# EasyEDA schematic ESP32 Bedsensor Dual with BME 30pin.json

## Sheets
1 Schematic: TITLE: ESP32 Bed Sensor - Dual with BME280; REV: 1.0; Date: 14-07-2022; Sheet: 1/1; Drawn By: Iain Hay
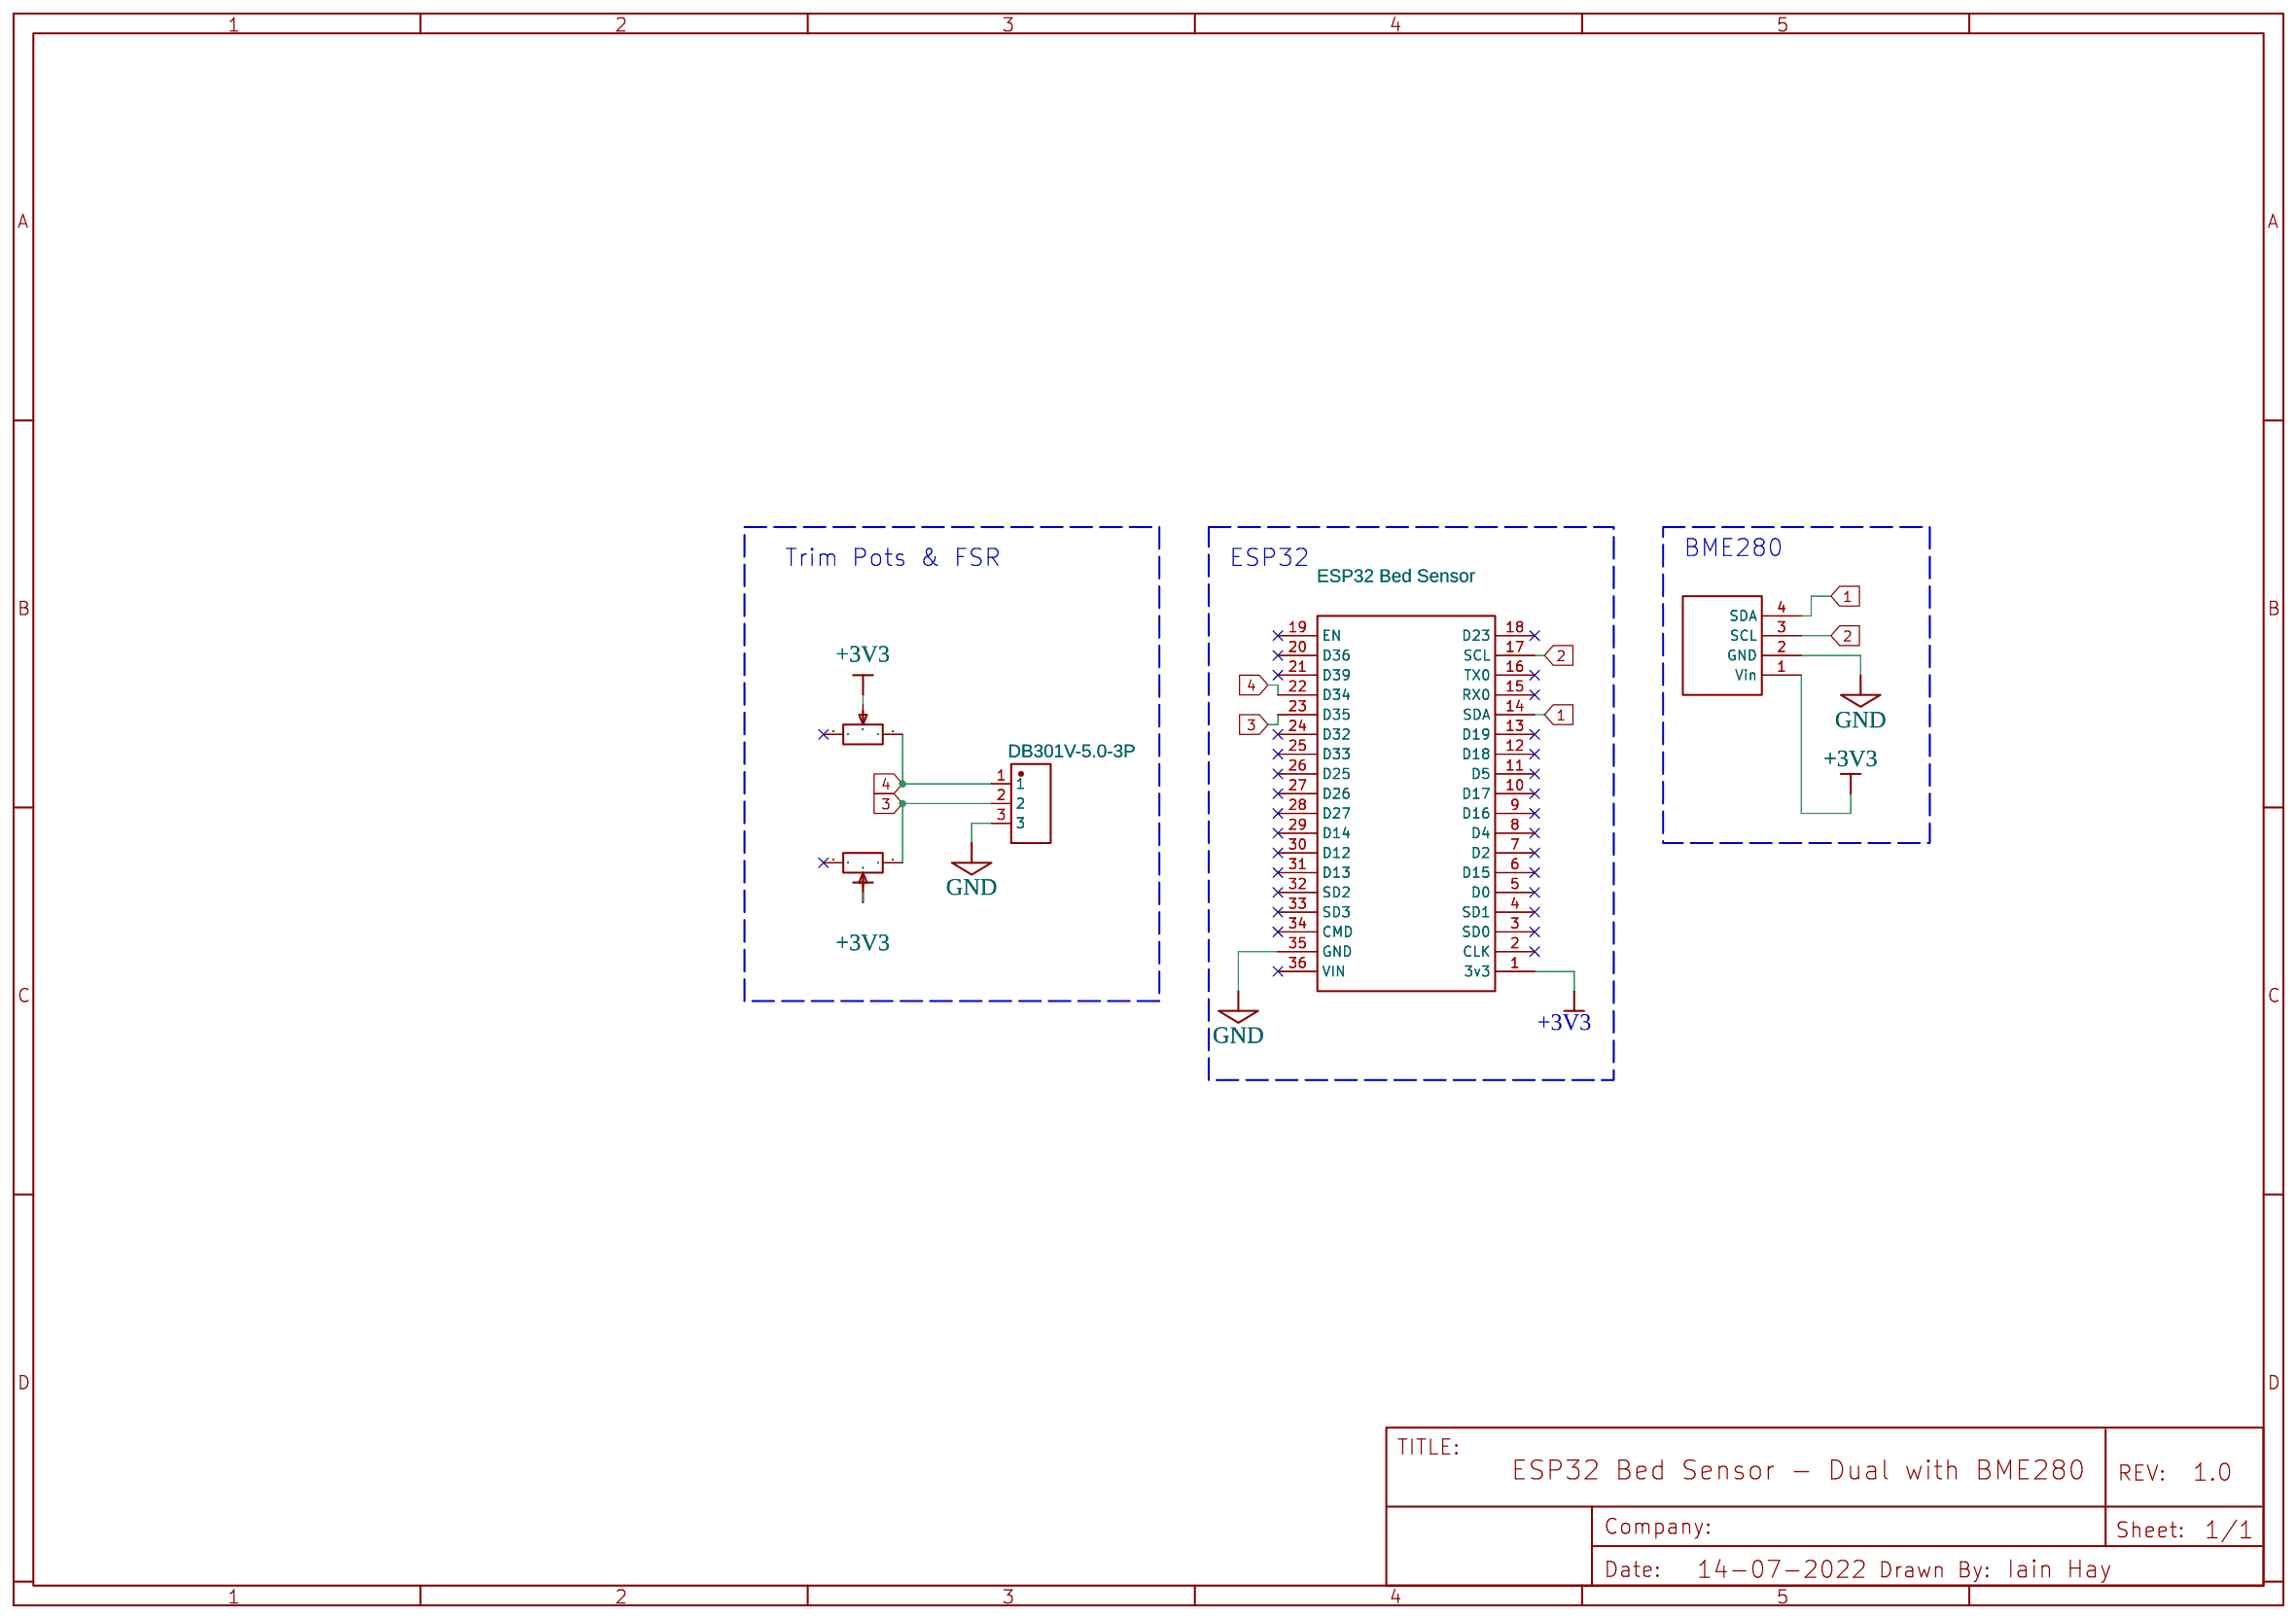
[diagram p0: Schematic]
2 V2 Schematic
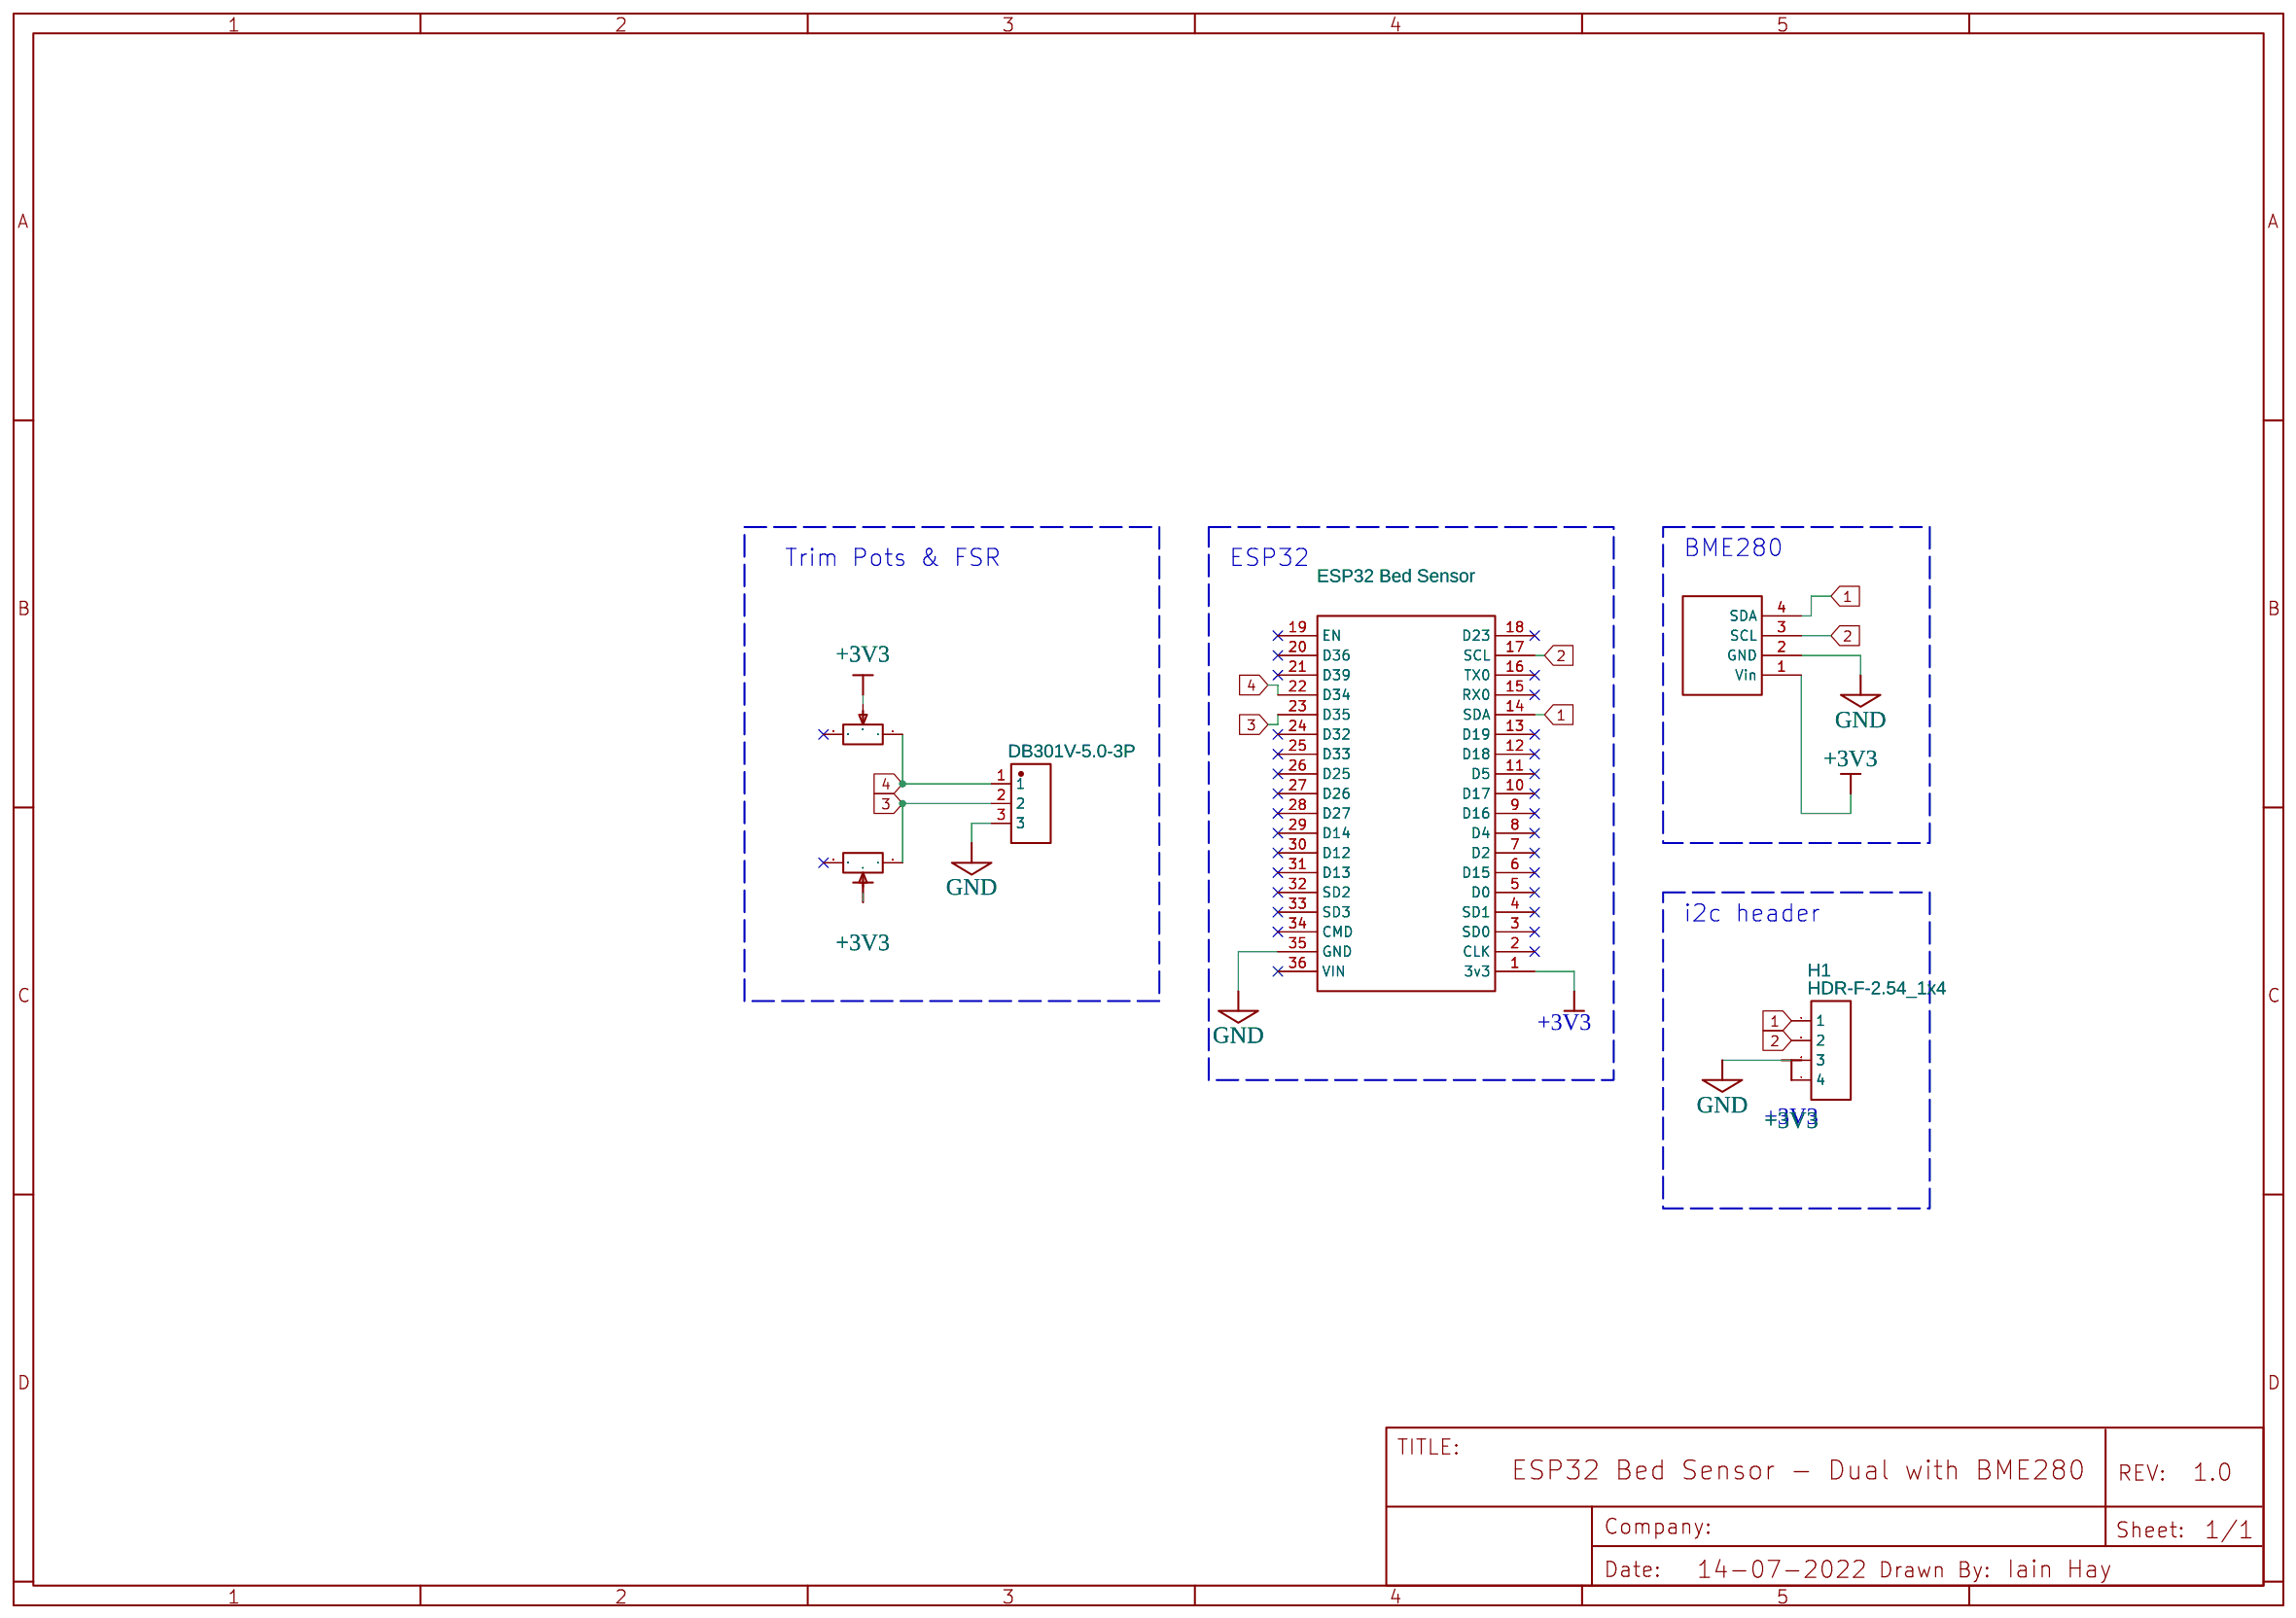
[diagram p1: V2 Schematic]

## Parts
sheet Schematic
Z1  BME280  [BME280]
Z2  ESP32 Bed Sensor  [ESP32_DOIT_DEVKIT_1_18X2]
Z3  DB301V-5.0-3P  [CONN-TH_DB301V-5.0-3P]
Z4  RHOS 3296W-1-103LF  [RES-ADJ_3296W]
Z5  RHOS 3296W-1-103LF  [RES-ADJ_3296W]
sheet V2 Schematic
H1  HDR-F-2.54_1x4  [HDR-F-2.54_1X4]
Z6  BME280  [BME280]
Z7  ESP32 Bed Sensor  [ESP32_DOIT_DEVKIT_1_18X2]
Z8  DB301V-5.0-3P  [CONN-TH_DB301V-5.0-3P]
Z9  RHOS 3296W-1-103LF  [RES-ADJ_3296W]
Z10  RHOS 3296W-1-103LF  [RES-ADJ_3296W]

## Library data of the parts
Z1 Z6 = BME280: Contributor: Kuba Jaszczur; Package Display: No
Z2 Z7 = ESP32_DOIT_DEVKIT_V1_36_SHIELD: Contributor: albert8413
Z3 Z8 = DB301V-5.0-3P: Supplier: LCSC; Supplier Part: C395881; Manufacturer: DIBO; Contributor: LCSC
Z4 Z5 Z9 Z10 = RHOS 3296W-1-103LF: Supplier Part: undefined; Supplier: LCSC; Manufacturer: ReliaPro; image: http://image.lceda.cn/szlcsc/C5026.jpg; Package Display: No
H1 = HDR-F-2.54_1x4: Supplier Part: C225501; Supplier: LCSC; Contributor: LCEDA_Lib

## Nets
+3V3: H1.4 Z1.1(Vin) Z2.1(3v3) Z4.2 Z5.2 Z6.1(Vin) Z7.1(3v3) Z9.2 Z10.2
GND: H1.3 Z1.2(GND) Z2.35(GND) Z3.3 Z6.2(GND) Z7.35(GND) Z8.3
1: H1.1 Z1.4(SDA) Z2.14(SDA) Z6.4(SDA) Z7.14(SDA)
2: H1.2 Z1.3(SCL) Z2.17(SCL) Z6.3(SCL) Z7.17(SCL)
3: Z2.23(D35) Z3.2 Z5.1 Z7.23(D35) Z8.2 Z10.1
4: Z2.22(D34) Z3.1 Z4.1 Z7.22(D34) Z8.1 Z9.1

Not connected (* = marked no-connect by the designer): Z2 2(CLK)* 3(SD0)* 4(SD1)* 5(D0)* 6(D15)* 7(D2)* 8(D4)* 9(D16)* 10(D17)* 11(D5)* 12(D18)* 13(D19)* 15(RX0)* 16(TX0)* 18(D23)* 19(EN)* 20(D36)* 21(D39)* 24(D32)* 25(D33)* 26(D25)* 27(D26)* 28(D27)* 29(D14)* 30(D12)* 31(D13)* 32(SD2)* 33(SD3)* 34(CMD)* 36(VIN)*; Z4 3*; Z5 3*; Z7 2(CLK)* 3(SD0)* 4(SD1)* 5(D0)* 6(D15)* 7(D2)* 8(D4)* 9(D16)* 10(D17)* 11(D5)* 12(D18)* 13(D19)* 15(RX0)* 16(TX0)* 18(D23)* 19(EN)* 20(D36)* 21(D39)* 24(D32)* 25(D33)* 26(D25)* 27(D26)* 28(D27)* 29(D14)* 30(D12)* 31(D13)* 32(SD2)* 33(SD3)* 34(CMD)* 36(VIN)*; Z9 3*; Z10 3*

## Notes on the sheets
sheet 1
- Trim Pots & FSR
- ESP32
- BME280
sheet 2
- Trim Pots & FSR
- ESP32
- BME280
- i2c header
- +3V3
